# Altium schematic sheet Mainboard_MCU_Func.SchDoc
size A4
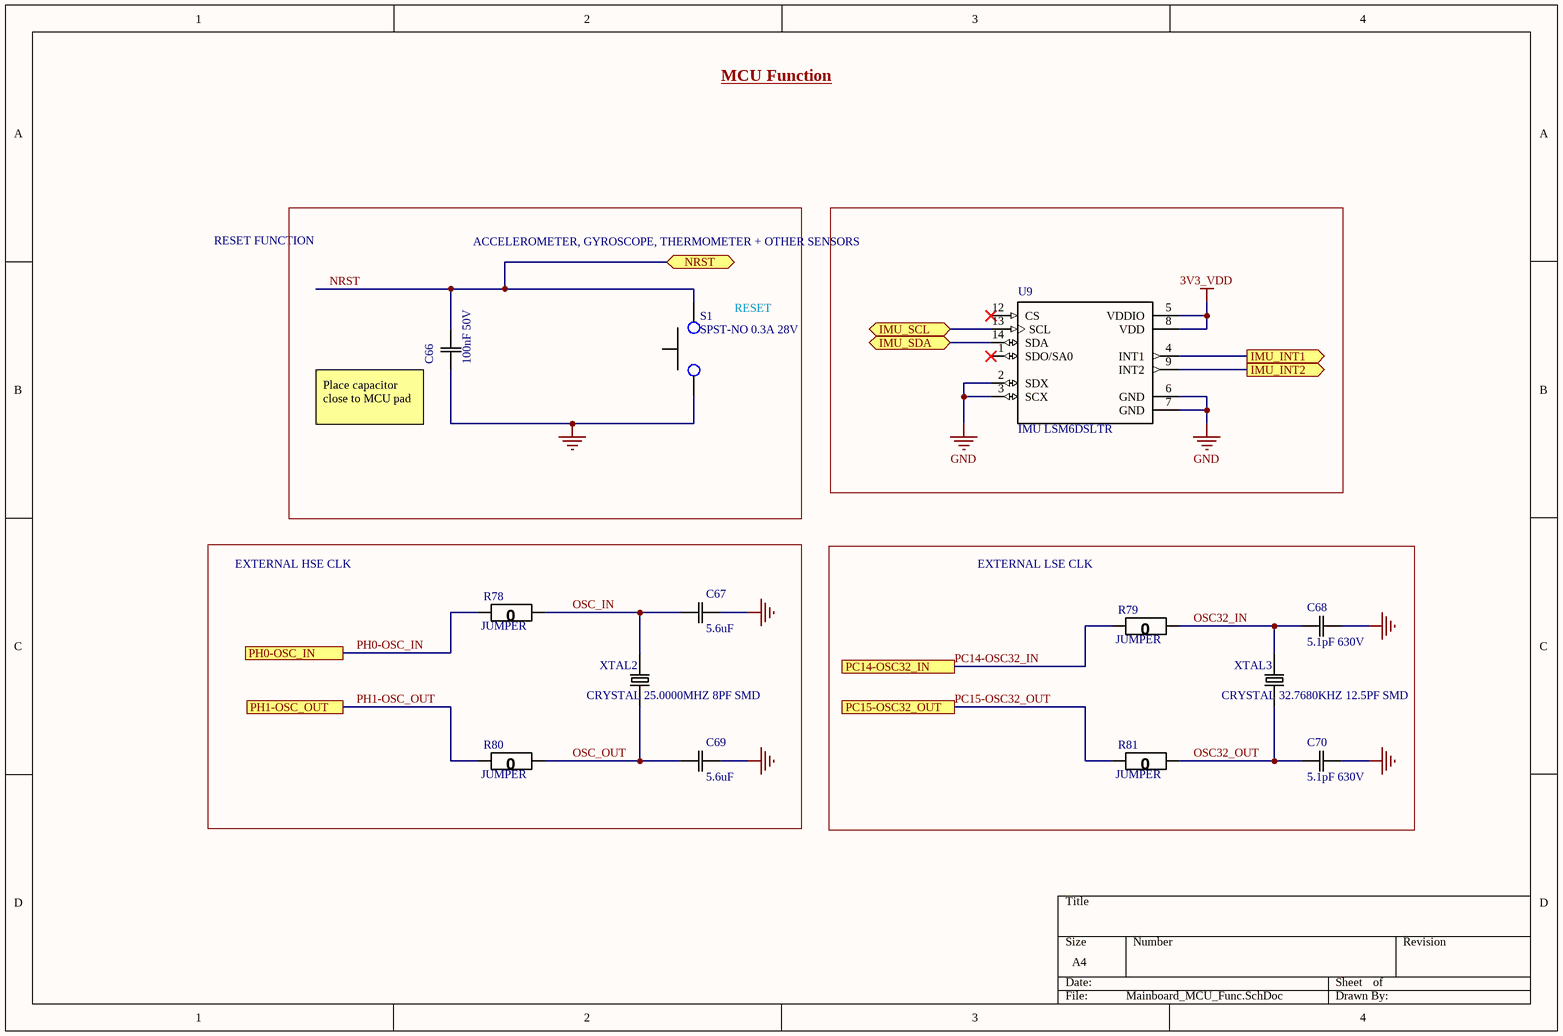
[diagram p0: Mainboard_MCU_Func.SchDoc]

## Parts
C66  100nF 50V  [0805]
C67  5.6uF  [0805]
C68  5.1pF 630V  [0805]
C69  5.6uF  [0805]
C70  5.1pF 630V  [0805]
R78  JUMPER  [0805]
R79  JUMPER  [0805]
R80  JUMPER  [0805]
R81  JUMPER  [0805]
S1  SPST-NO 0.3A 28V  [PB300STQ]
U9  IMU LSM6DSLTR  [LGA-14]
XTAL2  CRYSTAL 25.0000MHZ 8PF SMD  [SMD-2]
XTAL3  CRYSTAL 32.7680KHZ 12.5PF SMD  [SMD-2]

## Blocks framed on the sheet
ACCELEROMETER, GYROSCOPE, THERMOMETER + OTHER SENSORS: U9
EXTERNAL HSE CLK: C67 C69 R78 R80 XTAL2
EXTERNAL LSE CLK: C68 C70 R79 R81 XTAL3

## Ports
IMU_INT1 (out), IMU_INT2 (out), IMU_SCL (bidir), IMU_SDA (bidir), NRST (bidir), PC14-OSC32_IN, PC15-OSC32_OUT, PH0-OSC_IN, PH1-OSC_OUT

## Nets
3V3_VDD: U9.5(VDDIO) U9.8(VDD)
GND: C66.1(C1) C67.2(C2) C68.2(C2) C69.2(C2) C70.2(C2) S1.1 U9.2(SDX) U9.3(SCX) U9.6(GND) U9.7(GND)
IMU_INT1: U9.4(INT1) ; port IMU_INT1
IMU_INT2: U9.9(INT2) ; port IMU_INT2
IMU_SCL: U9.13(SCL) ; port IMU_SCL
IMU_SDA: U9.14(SDA) ; port IMU_SDA
NRST: C66.2(C2) S1.2 ; port NRST
OSC32_IN: C68.1(C1) R79.1(R1) XTAL3.2
OSC32_OUT: C70.1(C1) R81.1(R1) XTAL3.1
OSC_IN: C67.1(C1) R78.1(R1) XTAL2.2
OSC_OUT: C69.1(C1) R80.1(R1) XTAL2.1
PC14-OSC32_IN: R79.2(R2) ; port PC14-OSC32_IN
PC15-OSC32_OUT: R81.2(R2) ; port PC15-OSC32_OUT
PH0-OSC_IN: R78.2(R2) ; port PH0-OSC_IN
PH1-OSC_OUT: R80.2(R2) ; port PH1-OSC_OUT

Not connected (* = marked no-connect by the designer): U9 1(SDO/SA0)* 12(CS)*

## Notes on the sheet
- MCU Function
- RESET FUNCTION
- (near S1) RESET
- (near C66) Place capacitor close to MCU pad

## Library data of the parts
C66 = CAP 100nF 50V: CAP CER 0.1UF 50V X7R 0805; Tolerance: 10%; Package: 0805; Value: 100nF; Rating: 50V
C67 C69 = CAP 5.6uF 6.3V: CAP CER 5.6UF 6.3V X5R 0805; Tolerance: 10%; Package: 0805; Value: 5.6uF; Rating: 6.3V; Temperature Coefficient: X5R; Operating Temperature: -55°C ~ 85°C
C68 C70 = CAP 5.1pF 630V: CAP CER 5.1PF 630V C0G/NP0 0805; Tolerance: 10%; Rating: 50V; Package: 0805; Value: 5.1pF; Temperature Coefficient: C0G/NP0; Operating Temperature: -55°C ~ 125°C
R78-R81 = RES 0 JUMPER: RES SMD 0 OHM JUMPER GENERIC 0805; Value: 0; Package: 0805
S1 = SW PUSH NO: Pushbutton Switch SPST-NO Standard Through Hole; MF: E-Switch; Rating: 28V 0.3A; ComponentLink1Description: Digikey; ComponentLink1URL: https://www.digikey.ca/product-detail/en/e-switch/PB300STQ/EG5398-ND/6126493; ComponentLink2Description: Datasheet; ComponentLink2URL: https://sten-eswitch-13110800-production.s3.amazonaws.com/system/asset/product_line/data_sheet/222/PB300.pdf; Digikey: EG5398-ND; Digikey Link: https://www.digikey.ca/product-detail/en/e-switch/PB300STQ/EG5398-ND/6126493; MP: PB300STQ; Price: 3.40000 CAD
U9 = IMU LSM6DSLTR: IMU ACCEL/GYRO I2C/SPI 14LGA; MF: STMicroelectronics; SnapEDA_Link: https://www.snapeda.com/parts/LSM6DSLTR/STMicroelectronics/view-part/550517/?ref=snap; MP: LSM6DSLTR; Package: LGA-14 STMicroelectronics; Digikey: https://www.digikey.ca/product-detail/en/stmicroelectronics/LSM6DSLTR/497-16705-1-ND/6192805; Supplier 1: Digi-Key; Supplier Part Number 1: 497-16705-1-ND
XTAL2 = XTAL 25MHZ 8PF SMD: 25MHz ±50ppm Crystal 8pF 70 Ohms 2-SMD, No Lead; MP: NX5032GA-25.000000MHZ-LN-CD-1; MF: NDK America, Inc.; ESR: 70 Ohms; Package: 2-SMD, No Lead; Price: 0.95 CAD; Frequency: 25MHz; Digikey: 644-1041-1-ND; Digikey Link: https://www.digikey.ca/product-detail/en/ndk-america-inc/NX5032GA-25.000000MHZ-LN-CD-1/644-1041-1-ND/1128913; Load Capacitance: 8pF; Supplier 1: Digi-Key; Supplier Part Number 1: 644-1041-1-ND
XTAL3 = XTAL 32.7680KHZ 12.5PF SMD: 32.768kHz ±20ppm Crystal 12.5pF 70 kOhms 2-SMD, No Lead; MP: NX3215SA-32.768K-STD-MUA-8; MF: NDK America, Inc.; Package: 2-SMD, No Lead; Price: 1.04000 CAD; Frequency: 32.768kHz; Digikey: 644-1156-1-ND; Digikey Link: https://www.digikey.ca/en/products/detail/ndk-america-inc/NX3215SA-32-768K-STD-MUA-8/2261469?s=N4IgTCBcDaIGwBYEFoCMqCsc3IHIBEQBdAXyA; Load Capacitance: 12.5pF; ESR: 70 kOhms; ComponentLink1Description: Digikey; ComponentLink1URL: https://www.digikey.ca/en/products/detail/ndk-america-inc/NX3215SA-32-768K-STD-MUA-8/2261469; ComponentLink2Description: Datasheet; ComponentLink2URL: https://media.digikey.com/datasheets/production/702868/1/NX3215SA-32-768K-STD-MUA-8.html; Supplier 1: Digi-Key; Supplier Part Number 1: 644-1156-1-ND